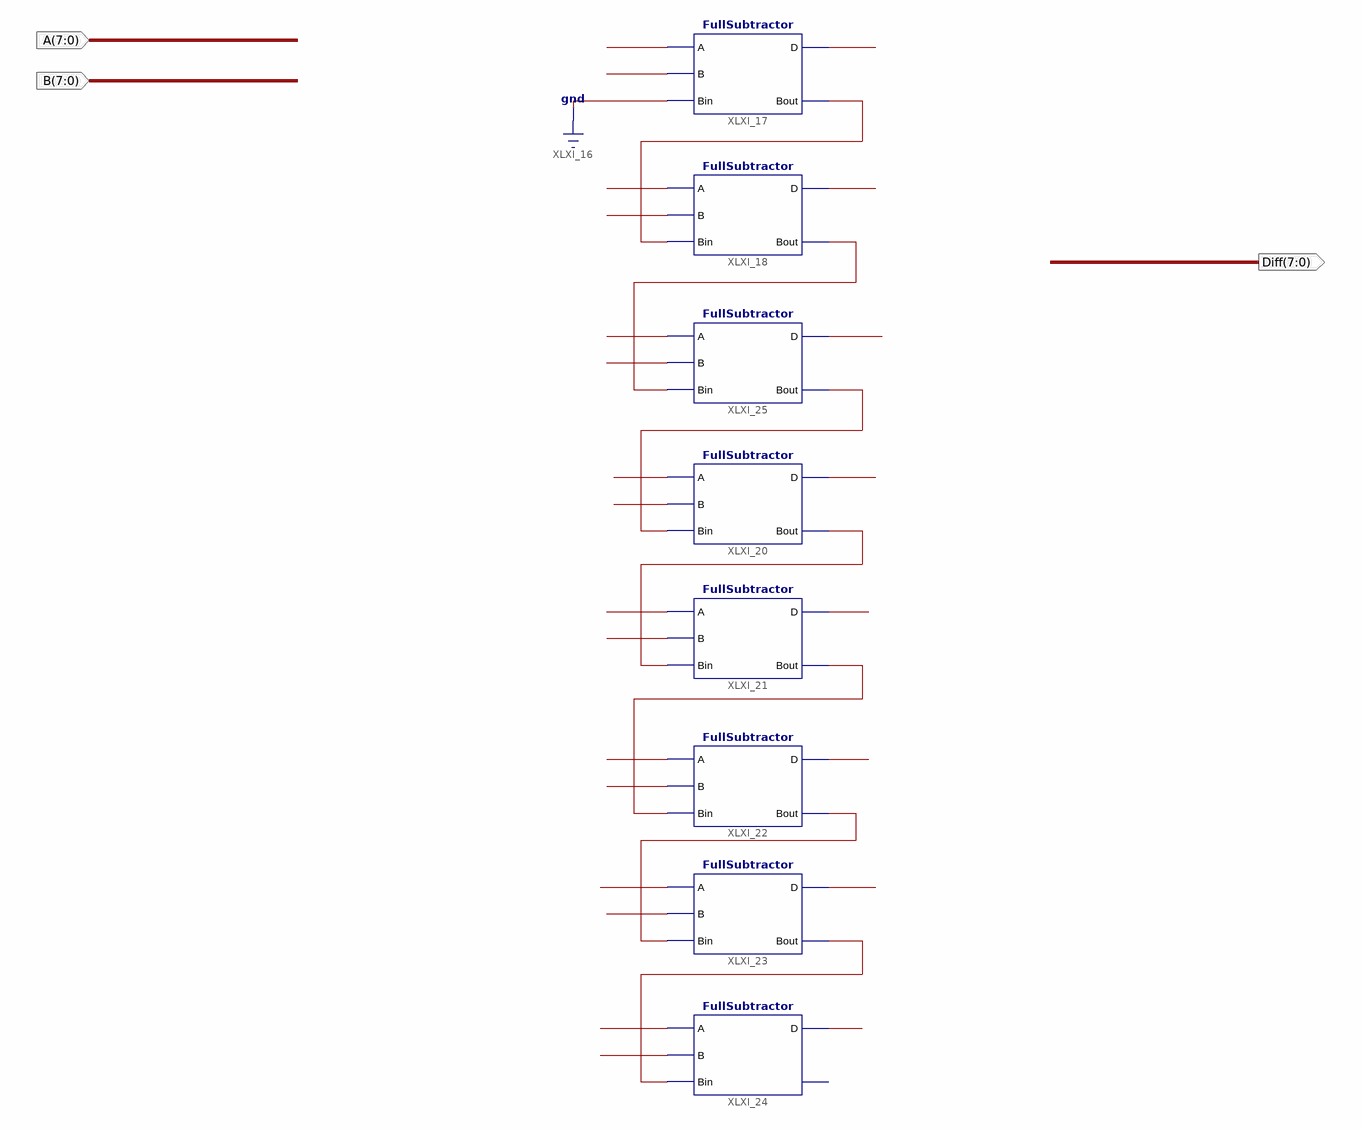
[diagram p0: schematic sheet 1]
// Xilinx ISE schematic EightBitSubtractor.sch (spartan6) as structural Verilog: 8 symbols, 3 ports
module EightBitSubtractor (
  input  [7:0] A,
  input  [7:0] B,
  output [7:0] Diff
);

  wire XLXN_1, XLXN_2, XLXN_3, XLXN_6, XLXN_7, XLXN_8, XLXN_9;

  FullSubtractor XLXI_17 (.A(A[0]), .B(B[0]), .Bin(1'b0), .D(Diff[0]), .Bout(XLXN_1));
  FullSubtractor XLXI_18 (.A(A[1]), .B(B[1]), .Bin(XLXN_1), .D(Diff[1]), .Bout(XLXN_3));
  FullSubtractor XLXI_20 (.A(A[3]), .B(B[3]), .Bin(XLXN_2), .D(Diff[3]), .Bout(XLXN_9));
  FullSubtractor XLXI_21 (.A(A[4]), .B(B[4]), .Bin(XLXN_9), .D(Diff[4]), .Bout(XLXN_6));
  FullSubtractor XLXI_22 (.A(A[5]), .B(B[5]), .Bin(XLXN_6), .D(Diff[5]), .Bout(XLXN_7));
  FullSubtractor XLXI_23 (.A(A[6]), .B(B[6]), .Bin(XLXN_7), .D(Diff[6]), .Bout(XLXN_8));
  FullSubtractor XLXI_24 (.A(A[7]), .B(B[7]), .Bin(XLXN_8), .D(Diff[7]));  // open: Bout
  FullSubtractor XLXI_25 (.A(A[2]), .B(B[2]), .Bin(XLXN_3), .D(Diff[2]), .Bout(XLXN_2));
endmodule
